# Altium schematic sheet FlameClock_1.1_sh2.SchDoc
size A3
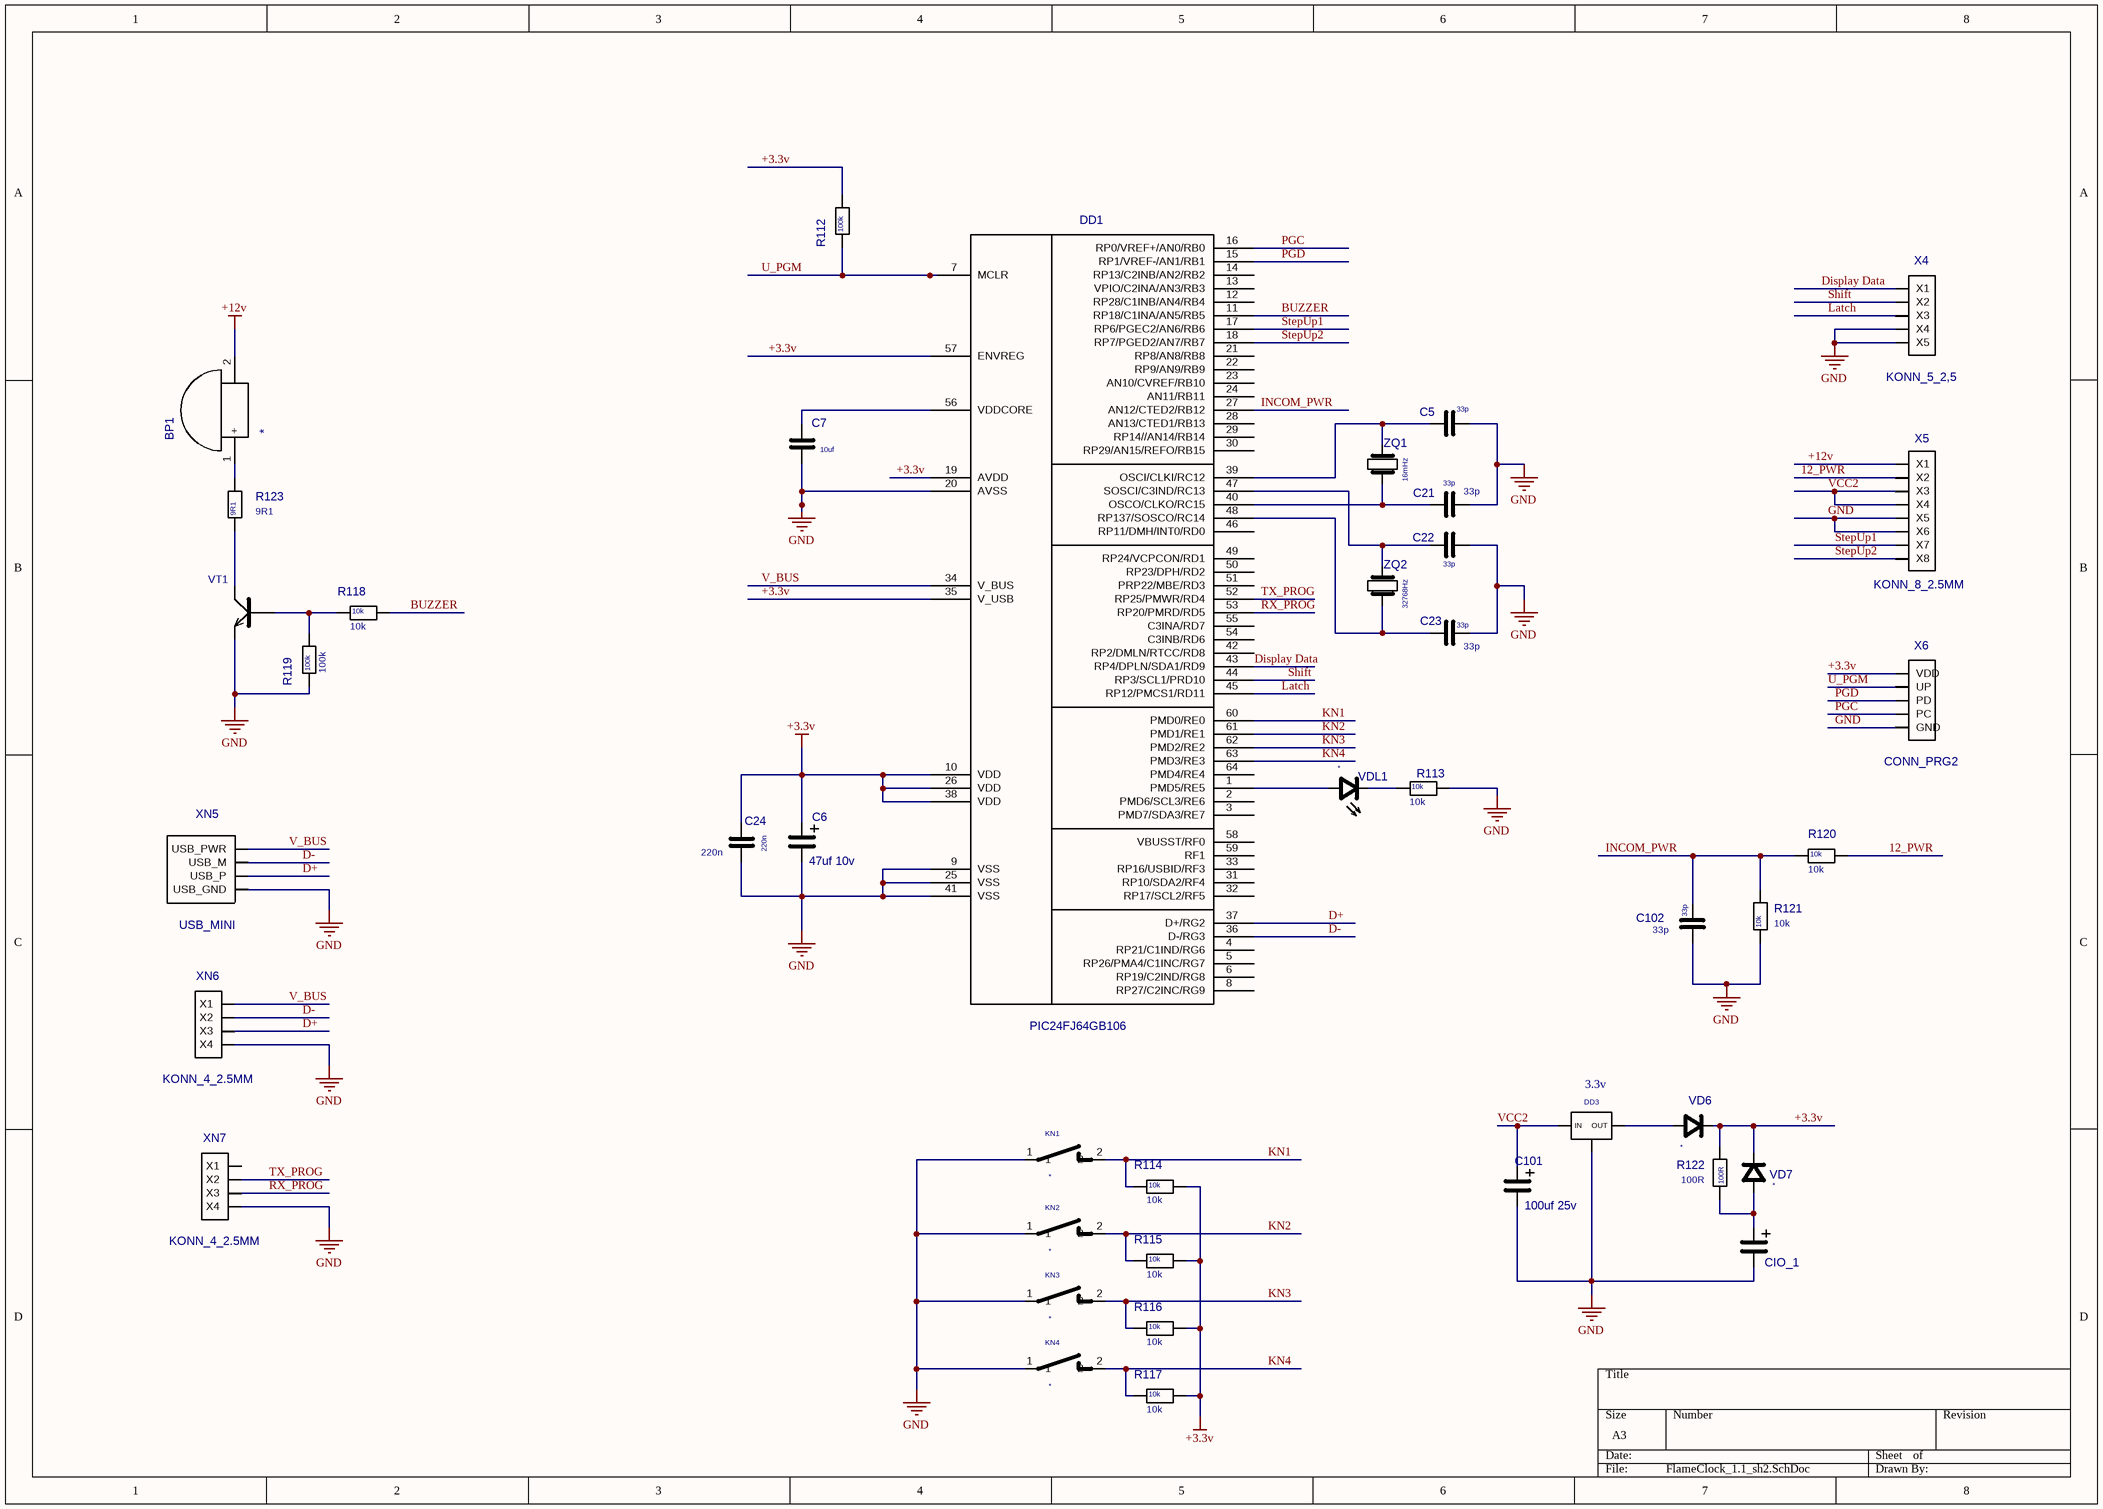
[diagram p0: FlameClock_1.1_sh2.SchDoc]

## Parts
BP1  *  [ZIPPER]
C5  33p  [CC0805_S]
C6  47uf 10v  [CC0805_C_TANTAL_POLAR]
C7  10uf  [CC0805_B]
C21  33p  [CC0805_S]
C22  33p  [CC0805_S]
C23  33p  [CC0805_S]
C24  220n  [CC0805_S]
C101  100uf 25v  [CE2.5]
C102  33p  [CC0805_S]
CIO_1  *  [CE10]  (value not drawn)
DD1  PIC24FJ64GB106  [TQFP-64]
DD3  value 3.3v  [SOT223]  (hidden comment: LD1117S)
KN1  *  [KNOP_12X12]
KN2  *  [KNOP_12X12]
KN3  *  [KNOP_12X12]
KN4  *  [KNOP_12X12]
R112  100k  [R0805_S]
R113  10k  [R0805_S]
R114  10k  [R0805_S]
R115  10k  [R0805_S]
R116  10k  [R0805_S]
R117  10k  [R0805_S]
R118  10k  [R0805_S]
R119  100k  [R0805_S]
R120  10k  [R0805_S]
R121  10k  [R0805_S]
R122  100R  [R0805_S]
R123  9R1  [R0805_S]
VD6  *  [DIOD_SOD123]
VD7  *  [DIOD_SOD123]
VDL1  *  [LED0805]
VT1  *  [SOT-23]  (value not drawn)
X4  KONN_5_2,5  [KONN_5_2.5MM]
X5  KONN_8_2.5MM  [KONN_8_2.5MM]
X6  CONN_PRG2  [CONN_PRG2]
XN5  USB_MINI  [USB_MINI]
XN6  KONN_4_2.5MM  [KONN_4_2.5MM]
XN7  KONN_4_2.5MM  [KONN_4_2.5MM]
ZQ1  16mHz  [ZQ]
ZQ2  32768Hz  [ZQ_CLOCK]

## Nets
+3.3v: C6.2(pl) C24.1 DD1.10(VDD) DD1.19(AVDD) DD1.26(VDD) DD1.35(V_USB) DD1.38(VDD) DD1.57(ENVREG) R112.1 R114.1 R115.1 R116.1 R117.1 R122.1 VD6.1(k) VD7.1(k) X6.1(VDD)
+12v: BP1.2(-) X5.1(X1)
GND: C5.2 C6.1(min) C7.2 C21.2 C22.2 C23.2 C24.2 C101.2 C102.1 CIO_1.2(min) DD1.9(VSS) DD1.20(AVSS) DD1.25(VSS) DD1.41(VSS) DD3.3(GND) KN1.1 KN2.1 KN3.1 KN4.1 R113.1 R119.2 R121.2 VT1.3(e) X4.4(X4) X4.5(X5) X5.5(X5) X5.6(X6) X6.5(GND) XN5.5(USB_GND) XN6.4(X4) XN7.4(X4)
12_PWR: R120.1 X5.2(X2)
BUZZER: DD1.11(RP18/C1INA/AN5/RB5) R118.1
D+: DD1.37(D+/RG2) XN5.3(USB_P) XN6.3(X3)
D-: DD1.36(D-/RG3) XN5.2(USB_M) XN6.2(X2)
Display Data: DD1.43(RP4/DPLN/SDA1/RD9) X4.1(X1)
INCOM_PWR: C102.2 DD1.27(AN12/CTED2/RB12) R120.2 R121.1
KN1: DD1.60(PMD0/RE0) KN1.2 R114.2
KN2: DD1.61(PMD1/RE1) KN2.2 R115.2
KN3: DD1.62(PMD2/RE2) KN3.2 R116.2
KN4: DD1.63(PMD3/RE3) KN4.2 R117.2
Latch: DD1.45(RP12/PMCS1/RD11) X4.3(X3)
PGC: DD1.16(RP0/VREF+/AN0/RB0) X6.4(PC)
PGD: DD1.15(RP1/VREF-/AN1/RB1) X6.3(PD)
RX_PROG: DD1.53(RP20/PMRD/RD5) XN7.3(X3)
Shift: DD1.44(RP3/SCL1/PRD10) X4.2(X2)
StepUp1: DD1.17(RP6/PGEC2/AN6/RB6) X5.7(X7)
StepUp2: DD1.18(RP7/PGED2/AN7/RB7) X5.8(X8)
TX_PROG: DD1.52(RP25/PMWR/RD4) XN7.2(X2)
U_PGM: DD1.7(MCLR) R112.2 X6.2(UP)
V_BUS: DD1.34(V_BUS) XN5.1(USB_PWR) XN6.1(X1)
VCC2: C101.1 DD3.1(IN) X5.3(X3) X5.4(X4)
NetBP1_1: BP1.1(+) R123.1
NetC5_1: C5.1 DD1.39(OSCI/CLKI/RC12) ZQ1.1
NetC7_1: C7.1 DD1.56(VDDCORE)
NetC21_1: C21.1 DD1.40(OSCO/CLKO/RC15) ZQ1.2
NetC22_1: C22.1 DD1.47(SOSCI/C3IND/RC13) ZQ2.1
NetC23_1: C23.1 DD1.48(RP137/SOSCO/RC14) ZQ2.2
NetCIO_1_1: CIO_1.1(pl) R122.2 VD7.2(a)
NetDD1_1: DD1.1(PMD5/RE5) VDL1.2
NetDD3_2: DD3.2(OUT) VD6.2(a)
NetR113_2: R113.2 VDL1.1
NetR118_2: R118.2 R119.1 VT1.1(b)
NetR123_2: R123.2 VT1.2(k)

Not connected (* = marked no-connect by the designer): DD1 2(PMD6/SCL3/RE6) 3(PMD7/SDA3/RE7) 4(RP21/C1IND/RG6) 5(RP26/PMA4/C1INC/RG7) 6(RP19/C2IND/RG8) 8(RP27/C2INC/RG9) 12(RP28/C1INB/AN4/RB4) 13(VPIO/C2INA/AN3/RB3) 14(RP13/C2INB/AN2/RB2) 21(RP8/AN8/RB8) 22(RP9/AN9/RB9) 23(AN10/CVREF/RB10) 24(AN11/RB11) 28(AN13/CTED1/RB13) 29(RP14//AN14/RB14) 30(RP29/AN15/REFO/RB15) 31(RP10/SDA2/RF4) 32(RP17/SCL2/RF5) 33(RP16/USBID/RF3) 42(RP2/DMLN/RTCC/RD8) 46(RP11/DMH/INT0/RD0) 49(RP24/VCPCON/RD1) 50(RP23/DPH/RD2) 51(PRP22/MBE/RD3) 54(C3INB/RD6) 55(C3INA/RD7) 58(VBUSST/RF0) 59(RF1) 64(PMD4/RE4); DD3 4; KN1 3 4; KN2 3 4; KN3 3 4; KN4 3 4; XN5 4 6 7 8 9; XN7 1(X1); ZQ2 3

## Library data of the parts
BP1 = Buzzer: Value: *
C5 C21-C24 C102 = C0805_S
  C5 C21-C23 C102: Value: 33p
  C24: Value: 220n
C6 = C0805_C_TAN_POLAR: Value: 47uf 10v
C7 = C0805_B: Value: 10uf
C101 = CE2.5_5MM: Value: 100uf 25v
CIO_1 = CE5.0_10MM: Value: *
KN1-KN4 = KNOP_12X12: Value: *
R112-R123 = R0805_S
  R112 R119: Value: 100k
  R113-R118 R120 R121: Value: 10k
  R122: Value: 100R
  R123: Value: 9R1
VD6 VD7 = DIODE_SOD123: pin to pad: 1>2 2>1; Value: *
VDL1 = L_DIODE0805: Value: *
VT1 = NPN_SOT23: Value: *
ZQ1 = ZQ: Value: 16mHz
ZQ2 = ZQ_CLOCK: Value: 32768Hz
DD1 = PIC24FJ64GB106: Value: *
X4 = KONN_5_2,5: Value: *
X5 = KONN_8_2.5MM: Value: *
X6 = CONN_PRG2: Value: *
XN5 = USB_MINI: Value: *
XN6 XN7 = KONN_4_2.5MM: Value: *